# Altium project RobosubDVLInterface.PrjPcb
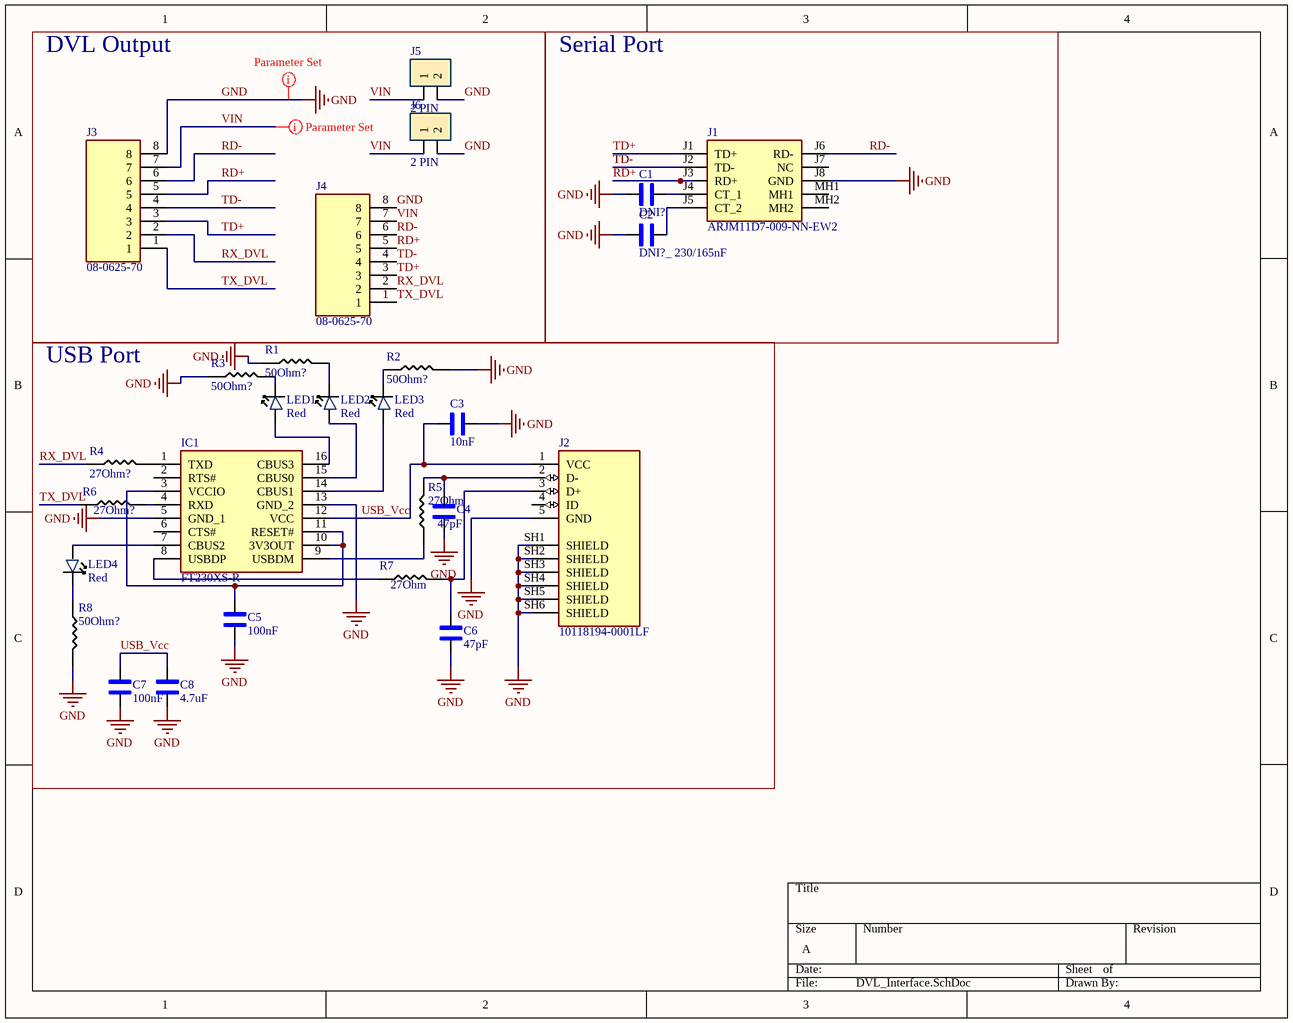
[diagram p0: DVL_Interface.SchDoc]
1 sheet, 27 parts. Net scope: global (net labels, ports and power ports of the same name join across sheets).
Board file: DVL_InterfaceRevA.PcbDoc

## Sheet DVL_Interface.SchDoc
size A; SheetNumber: 1; SheetTotal: 1

### Parts
C1  DNI?  [1206_Passive_Capacitor]
C2  DNI?_ 230/165nF  [1206_Passive_Capacitor]
C3  10nF  [1206_Passive_Capacitor]
C4  47pF  [1206_Passive_Capacitor]
C5  100nF  [1206_Passive_Capacitor]
C6  47pF  [1206_Passive_Capacitor]
C7  100nF  [1206_Passive_Capacitor]
C8  4.7uF  [1206_Passive_Capacitor]
IC1  FT230XS-R  [SOP64P599X175-16N]
J1  ARJM11D7-009-NN-EW2  [ARJM11D7009NNEW2]
J2  10118194-0001LF  [AMPHENOL_10118194-0001LF]
J3  08-0625-70  [HDRV8W51P0X254_1X8_2032X254X816P]
J4  08-0625-70  [HDRV8W51P0X254_1X8_2032X254X816P]
J5  2 PIN  [2_PIN_100MIL]
J6  2 PIN  [2_PIN_100MIL]
LED1  Red  [LED_1206]
LED2  Red  [LED_1206]
LED3  Red  [LED_1206]
LED4  Red  [LED_1206]
R1  value 50Ohm?  [1206_Passive_Resitor]  (hidden comment: 10k)
R2  value 50Ohm?  [1206_Passive_Resitor]  (hidden comment: 10k)
R3  value 50Ohm?  [1206_Passive_Resitor]  (hidden comment: 10k)
R4  value 27Ohm?  [1206_Passive_Resitor]  (hidden comment: 10k)
R5  27Ohm  [1206_Passive_Resitor]
R6  value 27Ohm?  [1206_Passive_Resitor]  (hidden comment: 10k)
R7  27Ohm  [1206_Passive_Resitor]
R8  value 50Ohm?  [1206_Passive_Resitor]  (hidden comment: 10k)

### Blocks framed on the sheet
DVL Output: J3-J6
Serial Port: C1 C2 J1
USB Port: C3-C8 IC1 J2 LED1-LED4 R1-R8

### Nets
GND: C1.2 C2.2 C3.1 C4.1 C5.1 C6.1 C7.1 C8.1 IC1.5(GND_1) IC1.13(GND_2) J1.J8(GND) J2.5(GND) J2.SH1(SHIELD) J2.SH2(SHIELD) J2.SH3(SHIELD) J2.SH4(SHIELD) J2.SH5(SHIELD) J2.SH6(SHIELD) J3.8 J4.8 J5.2 J6.2 R1.1 R2.2 R3.1 R8.2
RD+: J1.J3(RD+) J3.5 J4.5
RD-: J1.J6(RD-) J3.6 J4.6
RX_DVL: J3.2 J4.2 R4.1
TD+: J1.J1(TD+) J3.3 J4.3
TD-: J1.J2(TD-) J3.4 J4.4
TX_DVL: J3.1 J4.1 R6.1
USB_Vcc: C3.2 C7.2 C8.2 IC1.12(VCC) J2.1(VCC)
VIN: J3.7 J4.7 J5.1 J6.1
NetC1_1: C1.1 J1.J4(CT_1)
NetC2_1: C2.1 J1.J5(CT_2)
NetC4_2: C4.2 J2.2(D-) R5.2
NetC5_2: C5.2 IC1.3(VCCIO) IC1.10(3V3OUT) IC1.11(RESET#)
NetC6_2: C6.2 J2.3(D+) R7.2
NetIC1_1: IC1.1(TXD) R4.2
NetIC1_4: IC1.4(RXD) R6.2
NetIC1_7: IC1.7(CBUS2) LED4.1
NetIC1_8: IC1.8(USBDP) R7.1
NetIC1_9: IC1.9(USBDM) R5.1
NetIC1_14: IC1.14(CBUS1) LED3.1
NetIC1_15: IC1.15(CBUS0) LED2.1
NetIC1_16: IC1.16(CBUS3) LED1.1
NetLED1_2: LED1.2 R3.2
NetLED2_2: LED2.2 R1.2
NetLED3_2: LED3.2 R2.1
NetLED4_2: LED4.2 R8.1

Not connected (* = marked no-connect by the designer): IC1 2(RTS#) 6(CTS#); J1 J7(NC) MH1 MH2; J2 4(ID)

### Layout directives
rule Width Constraint [Pref Width = 20mil    Min Width = 10mil    Max Width = 100mil]: GND, VIN

### Library data of the parts
C1-C3 C5 C7 C8 = C_10uF_1206: 10uF ±10% 50V X5R 1206 Multilayer Ceramic Capacitors MLCC - SMD/SMT RoHS; MFR Part #: CL31A106KBHNNNE; Type: Basic; LCSC Part#: C13585; Datasheet: https://datasheet.lcsc.com/lcsc/1810221112_Samsung-Electro-Mechanics-CL31A106KBHNNNE_C13585.pdf
C4 C6 = C_47nF_1206: 47nF ±5% 50V C0G 1206 Multilayer Ceramic Capacitors MLCC - SMD/SMT RoHS; MFR Part #: GRM31M5C1H473JA01L; Type: Extended; LCSC Part#: C21812; Datasheet: https://datasheet.lcsc.com/lcsc/1810201313_Murata-Electronics-GRM31M5C1H473JA01L_C21812.pdf
IC1 = FT230XS-R: Integrated Circuit; Manufacturer_Name: FTDI Chip; Datasheet Link: http://www.ftdichip.com/Support/Documents/DataSheets/ICs/DS_FT230X.pdf; Height: 1.753mm; Manufacturer_Part_Number: FT230XS-R; Mouser Part Number: 895-FT230XS-R; Mouser Price/Stock: https://www.mouser.co.uk/ProductDetail/FTDI/FT230XS-R?qs=Gp1Yz1mis3XyCLeYOseSng%3D%3D; Arrow Part Number: FT230XS-R; Arrow Price/Stock: http://www.arrow.com/en/products/ft230xs-r/ftdi-chip
J1 = ARJM11D7-009-NN-EW2: Connector; Manufacturer_Name: ABRACON; Datasheet Link: https://abracon.com/Magnetics/ARJM11.pdf; Height: 14.05mm; Manufacturer_Part_Number: ARJM11D7-009-NN-EW2; Mouser Part Number: 815-RJM11D7009NNEW2; Mouser Price/Stock: https://www.mouser.co.uk/ProductDetail/ABRACON/ARJM11D7-009-NN-EW2?qs=YCa%2FAAYMW03eZFC4XXAjJg%3D%3D; Arrow Part Number: ARJM11D7-009-NN-EW2; Arrow Price/Stock: null?region=nac
J2 = 10118194-0001LF: Micro USB, Input Output Connectors, B TYPE RECEPTACLE with flange; MF: Amphenol ICC; SnapEDA_Link: https://www.snapeda.com/parts/10118194-0001LF/Amphenol+FCI/view-part/?ref=snap; Package: None; Value: *; MP: 10118194-0001LF; Check_prices: https://www.snapeda.com/parts/10118194-0001LF/Amphenol+FCI/view-part/?ref=eda
J3 J4 = 08-0625-70: Connector; Manufacturer_Name: ARIES; Datasheet Link: https://www.mouser.in/datasheet/2/35/12036-pin-line-header-1224908.pdf; Height: 8.16mm; Manufacturer_Part_Number: 08-0625-70; Mouser Part Number: 535-08-0625-70; Mouser Price/Stock: https://www.mouser.co.uk/ProductDetail/Aries-Electronics/08-0625-70?qs=BpaRKvA4VqGb7C%252By2JfgtQ%3D%3D
J5 J6 = JM_2_PIN_MALE: 2.54mm Straight 2 1 Header，Breakaway Through Hole,P=2.54mm Pin Header & Female Header ROHS; MFR Part #: B-2100S02P-A110; Type: Extended; Datasheet: https://datasheet.lcsc.com/lcsc/1811151421_Ckmtw-Shenzhen-Cankemeng-B-2100S02P-A110_C124375.pdf; LCSC Part#: C124375; Value: 2 PIN
LED1-LED4 = LED_RED_1206: Red 621~631nm 1206 Light Emitting Diodes (LED) RoHS; MFR Part #: 15-21/R6C-FQ1R1B/2T; Type: Extended; LCSC Part#: C93133; Datasheet: https://datasheet.lcsc.com/szlcsc/1811151241_Everlight-Elec-15-21-R6C-FQ1R1B-2T_C93133.pdf; Value: Red
R1-R4 R6 R8 = R_10KOhm_1206: 10 kOhms ±5% 0.25W, 1/4W Chip Resistor 1206 (3216 Metric) Automotive AEC-Q200 Thick Film; MFR Part #: RMCF1206FT10K0; Digikey Link: https://www.digikey.com/en/products/detail/stackpole-electronics-inc/RMCF1206FT10K0/1759669; LCSC Part#: C17902; Type: Basic
R5 R7 = R_22Ohm_1206: CHIP RESISTOR - SURFACE MOUNT 22OHMS ±1% 1/4W 1206 ROHS; MFR Part #: 1206W4F220JT5E; Type: Basic; LCSC Part#: C17958